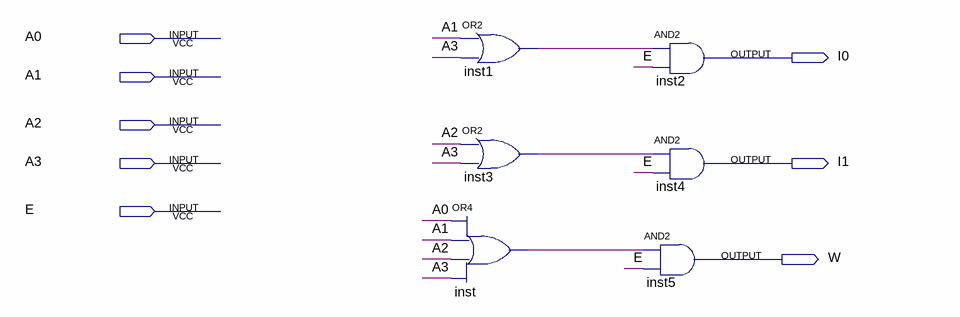
[diagram p0: schematic sheet]
// Quartus schematic CD4TO2.bdf as structural Verilog: 6 symbols, 8 pins
module CD4TO2 (
  input  A0,
  input  A1,
  input  A2,
  input  A3,
  input  E,
  output I0,
  output I1,
  output W
);

  wire inst1_out, inst3_out, inst_out;

  or inst1 (inst1_out, A1, A3);
  or inst3 (inst3_out, A2, A3);
  or inst (inst_out, A0, A1, A2, A3);
  and inst2 (I0, inst1_out, E);
  and inst4 (I1, inst3_out, E);
  and inst5 (W, inst_out, E);
endmodule
